# Altium schematic sheet ap-pam-VX.SchDoc: ATA Post Amplifier Module
size A1; Author: Dr. Alexander Pollak; DrawnBy: Dr. Alexander Pollak; DocumentNumber: 1; Revision: 1.0; SheetNumber: 1; SheetTotal: 1
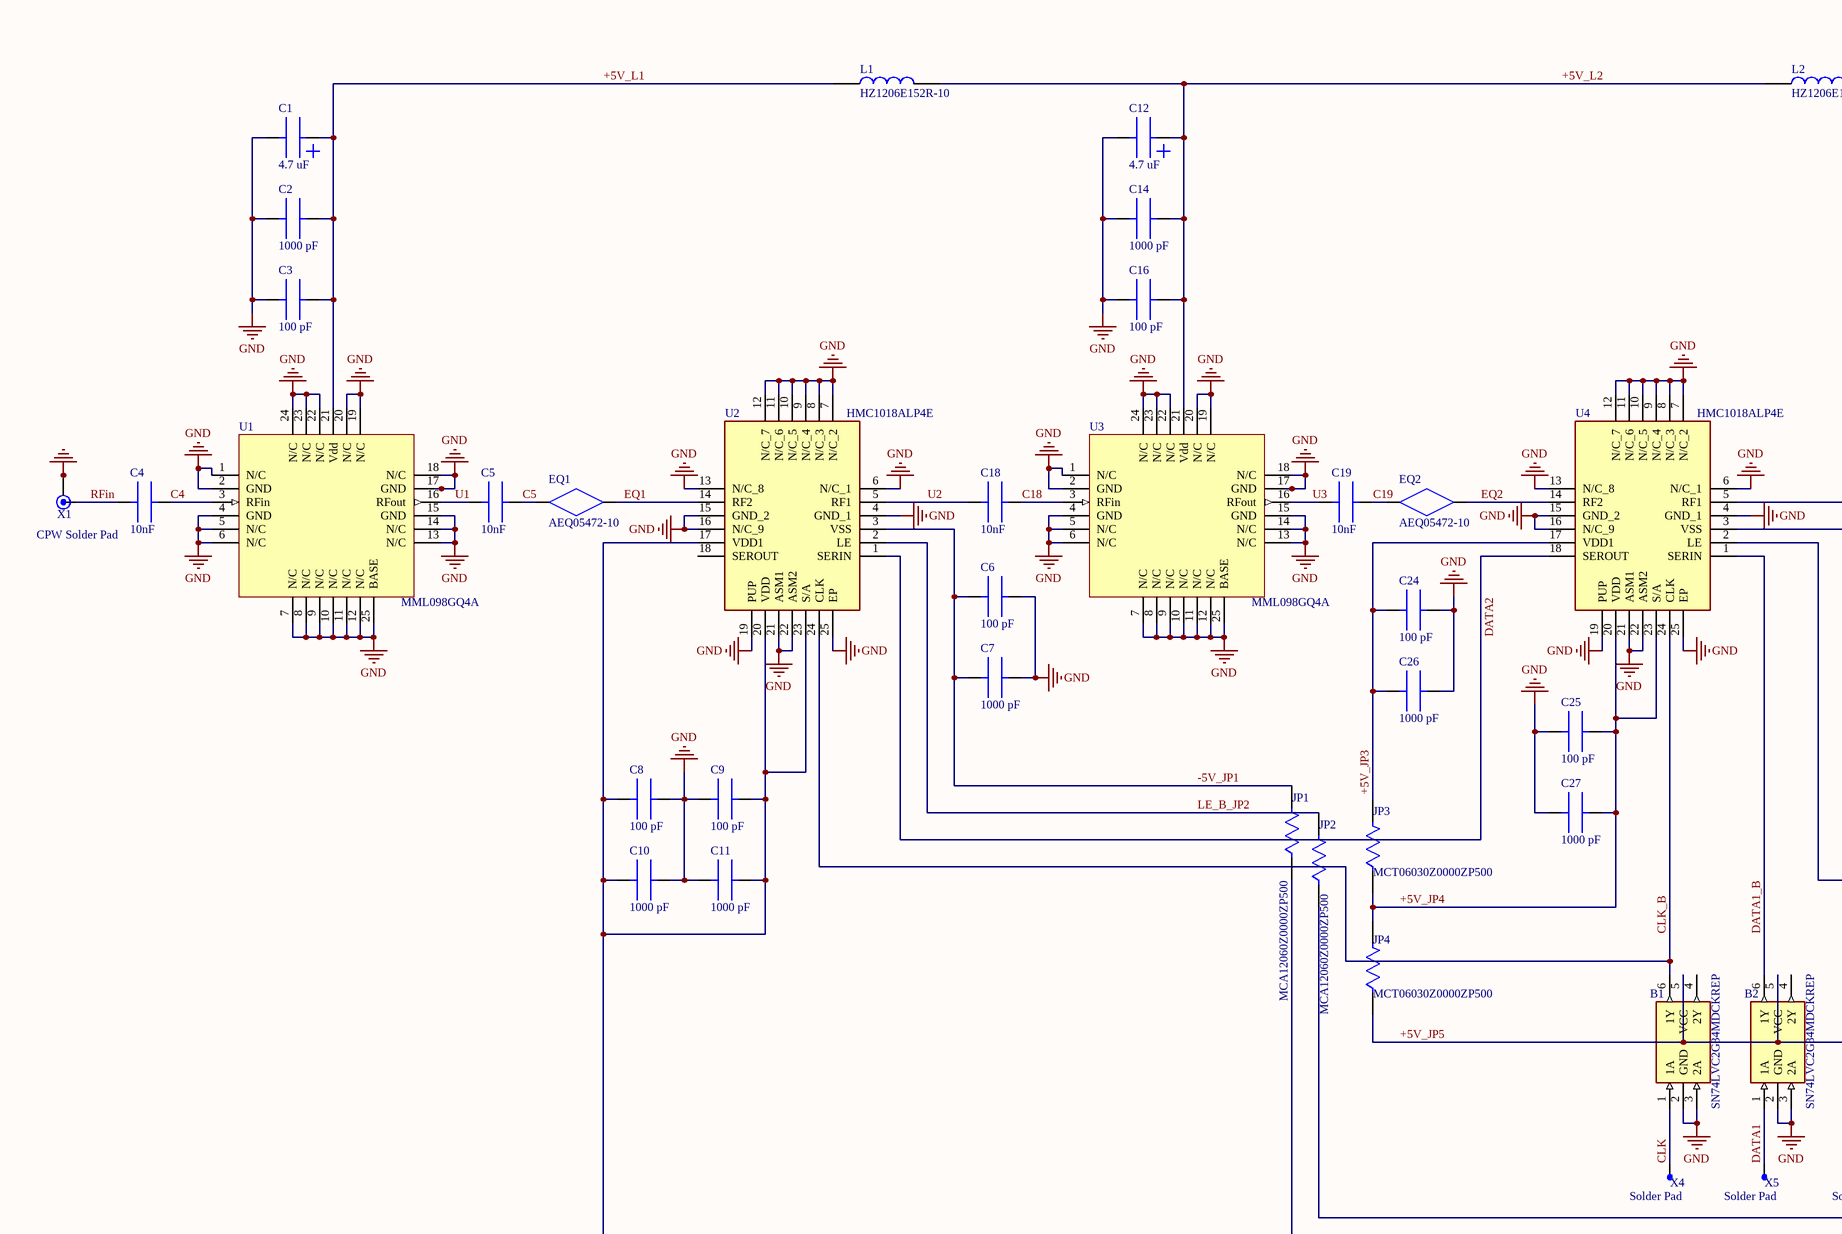
[diagram p0: ap-pam-VX.SchDoc, top left]
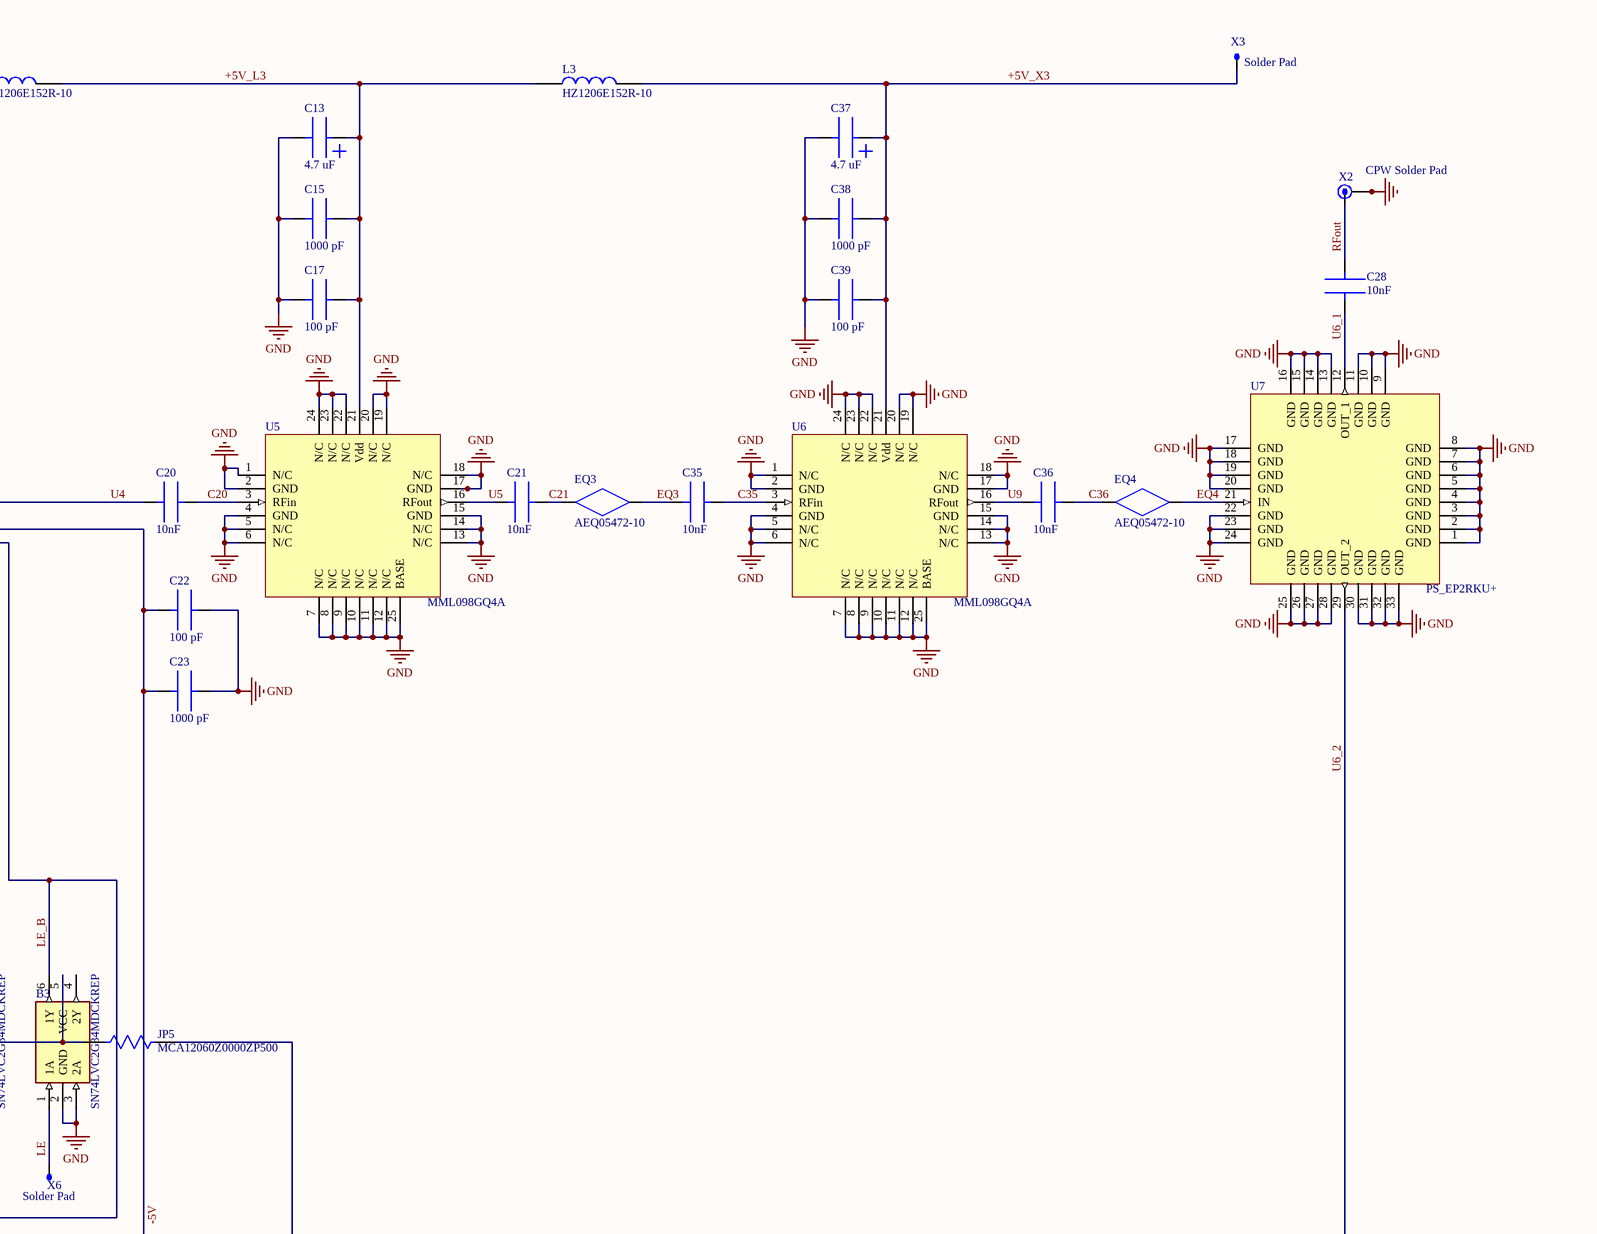
[diagram p1: ap-pam-VX.SchDoc, top right]
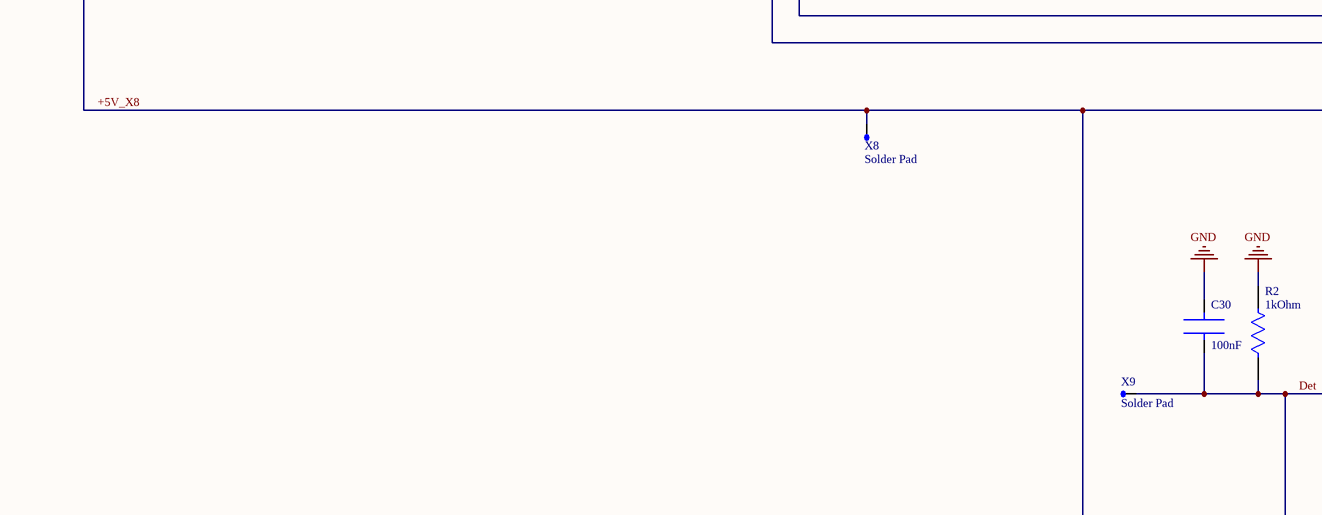
[diagram p2: ap-pam-VX.SchDoc, bottom left]
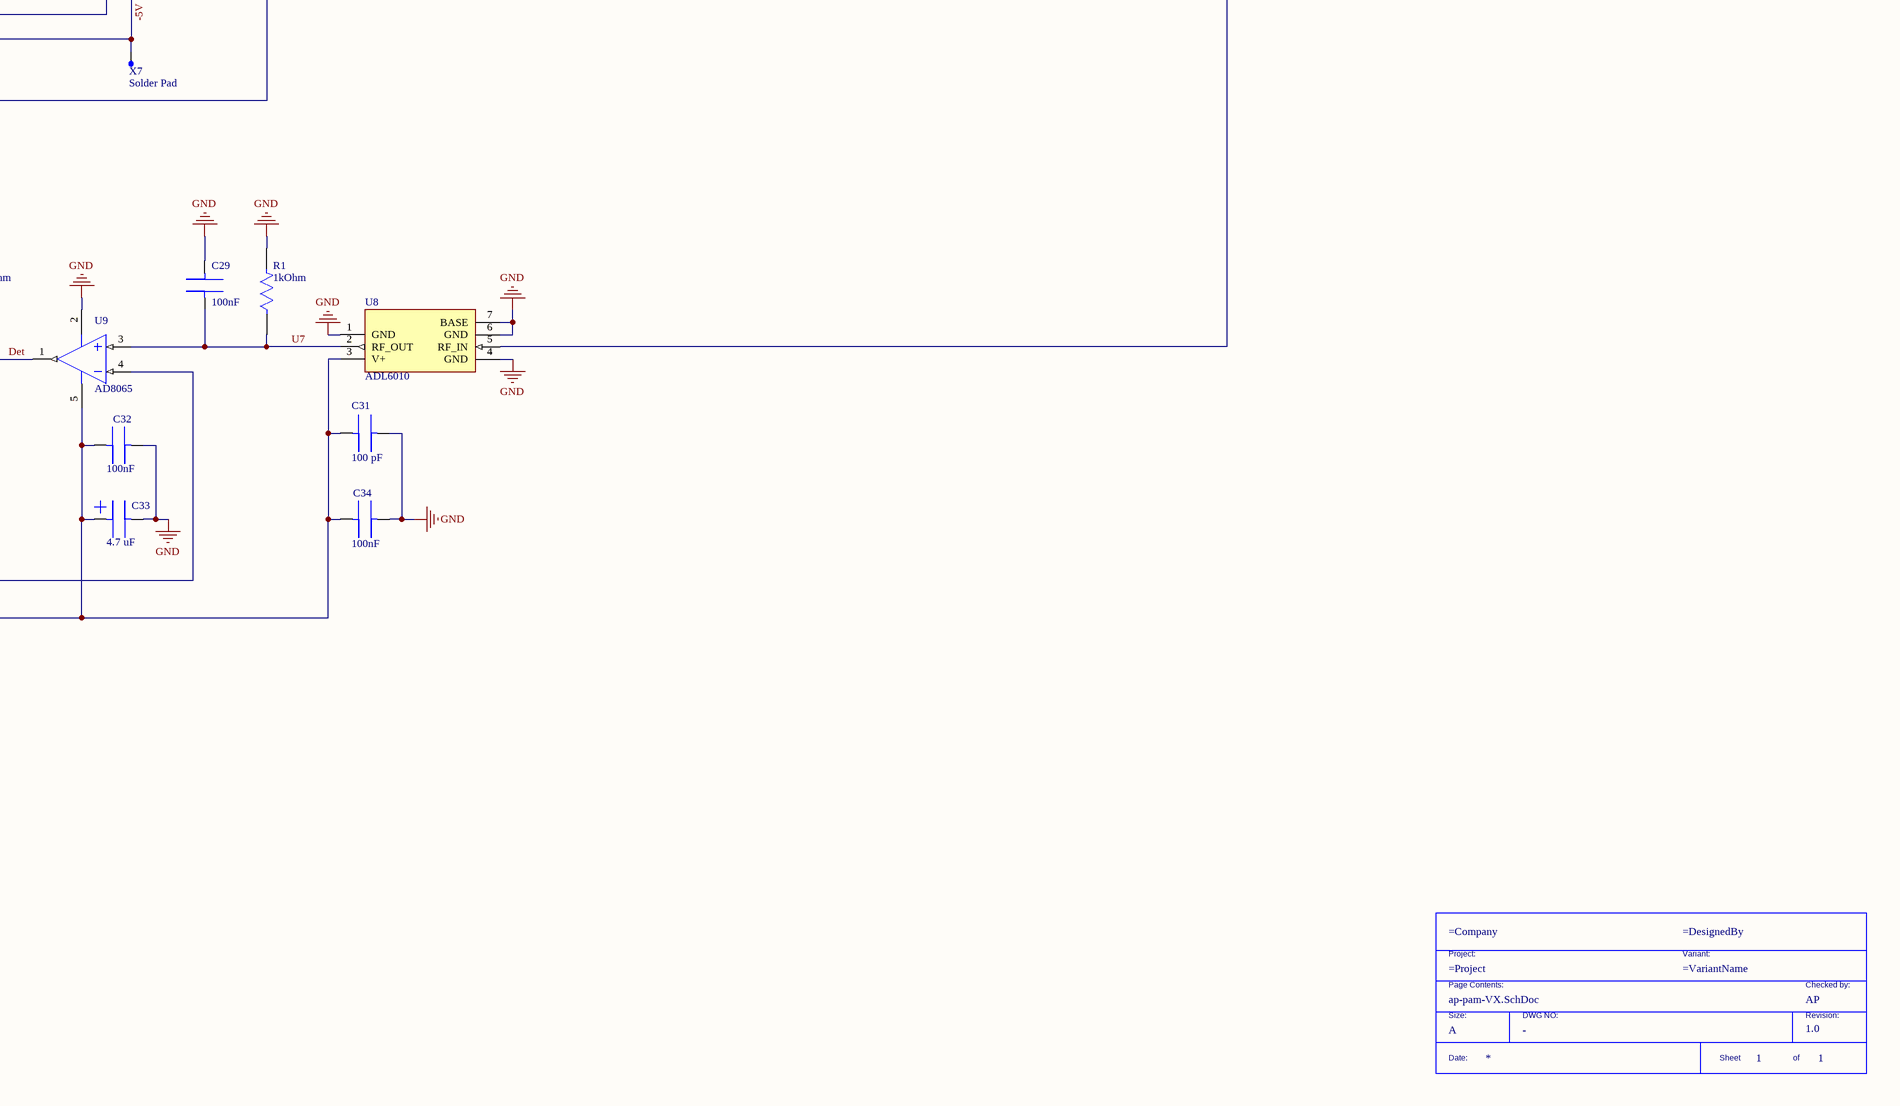
[diagram p3: ap-pam-VX.SchDoc, bottom right]

## Parts
*  Size: A  Checked by: AP  (graphical)
B1  SN74LVC2G34MDCKREP  [buf_SN74LVC2G34MDCKREP]
B2  SN74LVC2G34MDCKREP  [buf_SN74LVC2G34MDCKREP]
B3  SN74LVC2G34MDCKREP  [buf_SN74LVC2G34MDCKREP]
C1  4.7 uF  [C4_7uF]
C2  1000 pF  [C1000pF]
C3  100 pF  [C100pF]
C4  10nF  [C10nF]
C5  10nF  [C10nF]
C6  100 pF  [C100pF]
C7  1000 pF  [C1000pF]
C8  100 pF  [C100pF]
C9  100 pF  [C100pF]
C10  1000 pF  [C1000pF]
C11  1000 pF  [C1000pF]
C12  4.7 uF  [C4_7uF]
C13  4.7 uF  [C4_7uF]
C14  1000 pF  [C1000pF]
C15  1000 pF  [C1000pF]
C16  100 pF  [C100pF]
C17  100 pF  [C100pF]
C18  10nF  [C10nF]
C19  10nF  [C10nF]
C20  10nF  [C10nF]
C21  10nF  [C10nF]
C22  100 pF  [C100pF]
C23  1000 pF  [C1000pF]
C24  100 pF  [C100pF]
C25  100 pF  [C100pF]
C26  1000 pF  [C1000pF]
C27  1000 pF  [C1000pF]
C28  10nF  [C10nF]
C29  100nF  [C1000pF__C100nF]
C30  100nF  [C1000pF__C100nF]
C31  100 pF  [C100pF]
C32  100nF  [C1000pF__C100nF]
C33  4.7 uF  [C4_7uF]
C34  100nF  [C1000pF__C100nF]
C35  10nF  [C10nF]
C36  10nF  [C10nF]
C37  4.7 uF  [C4_7uF]
C38  1000 pF  [C1000pF__C100nF]
C39  100 pF  [C100pF]
EQ1  AEQ05472-10  [EQ_AEQ05472]
EQ2  AEQ05472-10  [EQ_AEQ05472]
EQ3  AEQ05472-10  [EQ_AEQ05472]
EQ4  AEQ05472-10  [EQ_AEQ05472]
JP1  MCA12060Z0000ZP500  [JP_MCA12060Z0000ZP500]
JP2  MCA12060Z0000ZP500  [JP_MCA12060Z0000ZP500]
JP3  MCT06030Z0000ZP500  [JP_small_MCT06030Z0000ZP500]
JP4  MCT06030Z0000ZP500  [JP_small_MCT06030Z0000ZP500]
JP5  MCA12060Z0000ZP500  [JP_MCA12060Z0000ZP500]
L1  HZ1206E152R-10  [FB_HZ1206E152R-10]
L2  HZ1206E152R-10  [FB_HZ1206E152R-10]
L3  HZ1206E152R-10  [FB_HZ1206E152R-10]
R1  1kOhm  [JP_R_MCT06030Z0000ZP500]
R2  1kOhm  [JP_R_MCT06030Z0000ZP500]
U1  MML098GQ4A  [amp_MML098GQ4A]
U2  HMC1018ALP4E  [Att_HMC101018ALPE]
U3  MML098GQ4A  [amp_MML098GQ4A]
U4  HMC1018ALP4E  [Att_HMC101018ALPE]
U5  MML098GQ4A  [amp_MML098GQ4A]
U6  MML098GQ4A  [amp_MML098GQ4A]
U7  PS_EP2RKU+  [PS_EP2RKU+]
U8  ADL6010  [Det_ADL6010ACPZN-R2]
U9  AD8065  [opAmp_AD8065ARTZ-REEL7]
X1  CPW Solder Pad  [CPW Edge Connector]
X2  CPW Solder Pad  [CPW Edge Connector]
X3  Solder Pad  [Solder Pad]
X4  Solder Pad  [Solder Pad]
X5  Solder Pad  [Solder Pad]
X6  Solder Pad  [Solder Pad]
X7  Solder Pad  [Solder Pad]
X8  Solder Pad  [Solder Pad]
X9  Solder Pad  [Solder Pad]

## Nets
GND: B1.2(GND) B1.3(2A) B2.2(GND) B2.3(2A) B3.2(GND) B3.3(2A) C1.2 C2.2 C3.2 C6.2 C7.2 C8.2 C9.2 C10.2 C11.2 C12.2 C13.2 C14.2 C15.2 C16.2 C17.2 C22.2 C23.2 C24.2 C25.2 C26.2 C27.2 C29.2 C30.2 C31.1 C32.1 C33.2 C34.1 C37.2 C38.2 C39.2 R1.2 R2.2 U1.1(N/C) U1.2(GND) U1.4(GND) U1.5(N/C) U1.6(N/C) U1.7(N/C) U1.8(N/C) U1.9(N/C) U1.10(N/C) U1.11(N/C) U1.12(N/C) U1.13(N/C) U1.14(N/C) U1.15(GND) U1.17(GND) U1.18(N/C) U1.19(N/C) U1.20(N/C) U1.22(N/C) U1.23(N/C) U1.24(N/C) U1.25(BASE) U2.4(GND_1) U2.6(N/C_1) U2.7(N/C_2) U2.8(N/C_3) U2.9(N/C_4) U2.10(N/C_5) U2.11(N/C_6) U2.12(N/C_7) U2.13(N/C_8) U2.15(GND_2) U2.16(N/C_9) U2.19(PUP) U2.21(ASM1) U2.22(ASM2) U2.25(EP) U3.1(N/C) U3.2(GND) U3.4(GND) U3.5(N/C) U3.6(N/C) U3.7(N/C) U3.8(N/C) U3.9(N/C) U3.10(N/C) U3.11(N/C) U3.12(N/C) U3.13(N/C) U3.14(N/C) U3.15(GND) U3.17(GND) U3.18(N/C) U3.19(N/C) U3.20(N/C) U3.22(N/C) U3.23(N/C) U3.24(N/C) U3.25(BASE) U4.4(GND_1) U4.6(N/C_1) U4.7(N/C_2) U4.8(N/C_3) U4.9(N/C_4) U4.10(N/C_5) U4.11(N/C_6) U4.12(N/C_7) U4.13(N/C_8) U4.15(GND_2) U4.16(N/C_9) U4.19(PUP) U4.21(ASM1) U4.22(ASM2) U4.25(EP) U5.1(N/C) U5.2(GND) U5.4(GND) U5.5(N/C) U5.6(N/C) U5.7(N/C) U5.8(N/C) U5.9(N/C) U5.10(N/C) U5.11(N/C) U5.12(N/C) U5.13(N/C) U5.14(N/C) U5.15(GND) U5.17(GND) U5.18(N/C) U5.19(N/C) U5.20(N/C) U5.22(N/C) U5.23(N/C) U5.24(N/C) U5.25(BASE) U6.1(N/C) U6.2(GND) U6.4(GND) U6.5(N/C) U6.6(N/C) U6.7(N/C) U6.8(N/C) U6.9(N/C) U6.10(N/C) U6.11(N/C) U6.12(N/C) U6.13(N/C) U6.14(N/C) U6.15(GND) U6.17(GND) U6.18(N/C) U6.19(N/C) U6.20(N/C) U6.22(N/C) U6.23(N/C) U6.24(N/C) U6.25(BASE) U7.1(GND) U7.2(GND) U7.3(GND) U7.4(GND) U7.5(GND) U7.6(GND) U7.7(GND) U7.8(GND) U7.9(GND) U7.10(GND) U7.11(GND) U7.13(GND) U7.14(GND) U7.15(GND) U7.16(GND) U7.17(GND) U7.18(GND) U7.19(GND) U7.20(GND) U7.22(GND) U7.23(GND) U7.24(GND) U7.25(GND) U7.26(GND) U7.27(GND) U7.28(GND) U7.30(GND) U7.31(GND) U7.32(GND) U7.33(GND) U8.1(GND) U8.4(GND) U8.6(GND) U8.7(BASE) U9.2(-VS) X1.2 X1.3 X2.2 X2.3
+5V_JP3: C24.1 C26.1 JP3.2 U4.17(VDD1)
+5V_JP4: C25.1 C27.1 JP3.1 JP4.2 U4.20(VDD) U4.23(S/A)
+5V_JP5: B1.5(VCC) B2.5(VCC) B3.5(VCC) JP4.1 JP5.1
+5V_L1: C1.1(+) C2.1 C3.1 L1.1 U1.21(Vdd)
+5V_L2: C12.1(+) C14.1 C16.1 L1.2 L2.1 U3.21(Vdd)
+5V_L3: C13.1(+) C15.1 C17.1 L2.2 L3.1 U5.21(Vdd)
+5V_X3: C37.1(+) C38.1 C39.1 L3.2 U6.21(Vdd) X3.1
+5V_X8: C8.1 C9.1 C10.1 C11.1 C31.2 C32.2 C33.1(+) C34.2 JP5.2 U2.17(VDD1) U2.20(VDD) U2.23(S/A) U8.3(V+) U9.5(+VS) X8.1
-5V: C22.1 C23.1 JP1.1 U4.3(VSS) X7.1
-5V_JP1: C6.1 C7.1 JP1.2 U2.3(VSS)
C4: C4.2 U1.3(RFin)
C5: C5.2 EQ1.1
C18: C18.2 U3.3(RFin)
C19: C19.2 EQ2.1
C20: C20.2 U5.3(RFin)
C21: C21.2 EQ3.1
C35: C35.2 U6.3(RFin)
C36: C36.2 EQ4.1
CLK: B1.1(1A) X4.1
CLK_B: B1.6(1Y) U2.24(CLK) U4.24(CLK)
DATA1: B2.1(1A) X5.1
DATA1_B: B2.6(1Y) U4.1(SERIN)
DATA2: U2.1(SERIN) U4.18(SEROUT)
Det: C30.1 R2.1 U9.1(VOUT) U9.4(-IN) X9.1
EQ1: EQ1.2 U2.14(RF2)
EQ2: EQ2.2 U4.14(RF2)
EQ3: C35.1 EQ3.2
EQ4: EQ4.2 U7.21(IN)
LE: B3.1(1A) X6.1
LE_B: B3.6(1Y) JP2.1 U4.2(LE)
LE_B_JP2: JP2.2 U2.2(LE)
RFin: C4.1 X1.1
RFout: C28.2 X2.1
U1: C5.1 U1.16(RFout)
U2: C18.1 U2.5(RF1)
U3: C19.1 U3.16(RFout)
U4: C20.1 U4.5(RF1)
U5: C21.1 U5.16(RFout)
U6_1: C28.1 U7.12(OUT_1)
U6_2: U7.29(OUT_2) U8.5(RF_IN)
U7: C29.1 R1.1 U8.2(RF_OUT) U9.3(+IN)
U9: C36.1 U6.16(RFout)

Not connected (* = marked no-connect by the designer): B1 4(2Y); B2 4(2Y); B3 4(2Y); U2 18(SEROUT)

## Notes on the sheet
- (in symbol TitleBlock) Project:; Variant:; Page Contents:; Checked by:; Size:; DWG NO:; Revision:; Date:; Sheet; of

## Library data of the parts
* = TitleBlock: Standard Title Block; DWG NO: -
B1-B3 = Buf_SN74LVC2G34MDCKREP: Enhanced Product Dual Buffer Gate; Manufacturer_Name: Texas Instruments; Geometry.Height: 1.1mm; Mouser Part Number: 595-SN74L2G34MDCKREP; Mouser Price/Stock: https://www.mouser.co.uk/ProductDetail/Texas-Instruments/SN74LVC2G34MDCKREP?qs=l4wu3mKjyfmQ87%252BWHVxJDg%3D%3D; Datasheet Link: https://datasheet.datasheetarchive.com/originals/distributors/Datasheets-SFU2/DSASFU100028688.pdf; Manufacturer Part Number: SN74LVC2G34MDCKREP
C1 C12 C13 C33 C37 = C7_4uF_TH3A475K010C2900: Tantalum Capacitor, Polarized, Tantalum (dry/solid), 10V, 10% +Tol, 10% -Tol, 4.7uF, Surface Mount, 1306; Manufacturer: Vishay Sprague; ESR (Equivalent Series Resistance): 2.9R; Leakage Current: 500nA; Ripple Current: 160mA; Tan Delta: 0.06; Reference Standard: AEC-Q200; Supplier: Future Electronics; Supplier Part Number: 4924098; Manufacturer Part Number: TH3A475K010C2900; RoHS: Yes; Category: Tantalum Capacitors; Stock: 2000; Pricing: 2000=0.178, 4000=0.175, 6000=0.173, 8000=0.171, 10000=0.166 (USD); Mounting Technology: Surface Mount; Pins: 2; Dielectric Material: Tantalum; Package Shape: Rectangular; Case/Package: 1206; Terminal Finish: Tin; Min Operating Temperature: -55°C; Max Operating Temperature: 150°C; JESD-609 Code: e3; Polarity: Polarized; Value: 4.7uF; Capacitor Type: Tantalum; Tolerance  (fill in as +-): 10%; Package Style: SMTMeter; Packaging: Tape and Reel; Tolerance (fill in as +-): 10%; Rated DC Voltage (URdc): 10V; Termination: J BEND; Length: 3.2mm; Width: 1.6mm; Height: 1.6mm; Reach SVHC Compliant: Yes; RoHS Compliant: Yes; ComponentLink1URL: https://datasheet.ciiva.com:443/pdfs/VipMasterIC/IC/VISH/VISH-S-A0010085390/VISH-S-A0010085390-1.pdf?src-supplier=IHS+Markit; ComponentLink1Description: https://datasheet.ciiva.com:443/pdfs/VipMasterIC/IC/VISH/VISH-S-A0010085390/VISH-S-A0010085390-1.pdf?src-supplier=IHS+Markit; ComponentLink2URL: https://datasheet.ciiva.com/268/th3-268785.pdf?src-supplier=Digikey; ComponentLink2Description: https://datasheet.ciiva.com/268/th3-268785.pdf?src-supplier=Digikey; ComponentLink3URL: https://datasheet.ciiva.com/16360/th3-16360891.pdf?src-supplier=Future+Electronics; ComponentLink3Description: https://datasheet.ciiva.com/16360/th3-16360891.pdf?src-supplier=Future+Electronics
C2 C7 C10 C11 C14 C15 C23 C26 C27 = GCM1885C1H102FA16D: Ceramic Capacitor, Multilayer, Ceramic, 50V, 1% +Tol, 1% -Tol, C0G, 30ppm/Cel TC, 0.001uF, Surface Mount, 0603; Manufacturer: Murata; Value: 1nF; Multilayer: Yes; Reference Standard: AEC-Q200; Supplier: Mouser; Supplier Part Number: 81-GCM1885C1H102FA6D; Manufacturer Part Number: GCM1885C1H102FA16D; RoHS: Yes; Category: Ceramic Capacitors; Stock: 27229; Pricing: 1=0.35, 10=0.229, 50=0.229, 100=0.138, 1000=0.092, 10000=0.074 (USD); Mounting Technology: Surface Mount; Pins: 2; Dielectric Material: Ceramic; Package Shape: Rectangular; Case/Package: 0603; Min Operating Temperature: -55°C; Max Operating Temperature: 125°C; Capacitor Type: Ceramic; Tolerance  (fill in as +-): 1%; Packaging: Tape and Reel; Tolerance (fill in as +-): 1%; Rated DC Voltage (URdc): 50V; Temperature Characteristics Code: C0G; Termination: Wraparound; Reach SVHC Compliant: Yes; RoHS Compliant: Yes; ComponentLink1URL: https://datasheet.ciiva.com:443/pdfs/VipMasterIC/IC/MURE/MURE-S-A0004370842/MURE-S-A0004372260-1.pdf?src-supplier=IHS+Markit; ComponentLink1Description: https://datasheet.ciiva.com:443/pdfs/VipMasterIC/IC/MURE/MURE-S-A0004370842/MURE-S-A0004372260-1.pdf?src-supplier=IHS+Markit
C3 C6 C8 C9 C16 C17 C22 C24 C25 = GRM1555C2A101FA01D: Multilayer Ceramic Capacitors MLCC - SMD/SMT 100 pF 100 VDC 1% 0402 C0G (NP0); Manufacturer: Murata; Supplier: Mouser; Supplier Part Number: 81-GRM1555C2A11FA1D; Manufacturer Part Number: GRM1555C2A101FA01D; RoHS: No; Stock: 21646; Pricing: 1=0.18, 10=0.119, 50=0.119, 100=0.06, 1000=0.039, 10000=0.035 (USD)
C4 C5 C18-C21 C28 C35 C36 = C10nF_939113733510: Manufacturer: Murata; Supplier: Mouser; Supplier Part Number: 961-939113733510; Manufacturer Part Number: 939113733510; RoHS: No; Stock: 402; Pricing: 1000=3.63, 10000=3.49 (USD)
C29 C30 C32 C34 = C100nF_GCM188R71C104KA37J: Ceramic Capacitor, Multilayer, Ceramic, 16V, 10% +Tol, 10% -Tol, X7R, 15% TC, 0.1uF, Surface Mount, 0603; Manufacturer: Murata; Multilayer: Yes; Reference Standard: AEC-Q200; Supplier: Mouser; Supplier Part Number: 81-GCM188R71C104KA7J; Manufacturer Part Number: GCM188R71C104KA37J; RoHS: Yes; Category: Ceramic Capacitors; Stock: 1116664; Pricing: 1=0.17, 10=0.097, 50=0.097, 100=0.063, 1000=0.044, 10000=0.031 (USD); Mounting Technology: Surface Mount; Pins: 2; Dielectric Material: Ceramic; Package Shape: Rectangular; Case/Package: 0603; Terminal Finish: Nickel; Min Operating Temperature: -55°C; Max Operating Temperature: 125°C; JESD-609 Code: e3; Value: 100nF; Capacitor Type: Ceramic; Tolerance  (fill in as +-): 10%; Package Style: SMTMeter; Packaging: Tape and Reel; Tolerance (fill in as +-): 10%; Rated DC Voltage (URdc): 16V; Temperature Characteristics Code: X7R; Termination: Wraparound; Length: 1.6mm; Width: 0.8mm; Height: 0.9mm; Reach SVHC Compliant: Yes; RoHS Compliant: Yes; ComponentLink1URL: https://datasheet.ciiva.com:443/pdfs/VipMasterIC/IC/MURE/MURE-S-A0004370842/MURE-S-A0004371613-1.pdf?src-supplier=IHS+Markit; ComponentLink1Description: https://datasheet.ciiva.com:443/pdfs/VipMasterIC/IC/MURE/MURE-S-A0004370842/MURE-S-A0004371613-1.pdf?src-supplier=IHS+Markit; ComponentLink2URL: https://datasheet.ciiva.com/18183/getdatasheetpartid-140967-18183600.pdf?src-supplier=Verical; ComponentLink2Description: https://datasheet.ciiva.com/18183/getdatasheetpartid-140967-18183600.pdf?src-supplier=Verical; ComponentLink3URL: https://datasheet.ciiva.com/29540/product-29540843.pdf?src-supplier=Digikey; ComponentLink3Description: https://datasheet.ciiva.com/29540/product-29540843.pdf?src-supplier=Digikey; ComponentLink4URL: https://datasheet.ciiva.com/29540/product-29540844.pdf?src-supplier=Digikey; ComponentLink4Description: https://datasheet.ciiva.com/29540/product-29540844.pdf?src-supplier=Digikey; ComponentLink5URL: https://datasheet.ciiva.com/29540/product-29540842.pdf?src-supplier=Digikey; ComponentLink5Description: https://datasheet.ciiva.com/29540/product-29540842.pdf?src-supplier=Digikey
C31 C39 = C100pF_GRM1555C2A101FA01D: Multilayer Ceramic Capacitors MLCC - SMD/SMT 100 pF 100 VDC 1% 0402 C0G (NP0); Manufacturer: Murata; Supplier: Mouser; Supplier Part Number: 81-GRM1555C2A11FA1D; Manufacturer Part Number: GRM1555C2A101FA01D; RoHS: No; Stock: 21646; Pricing: 1=0.18, 10=0.119, 50=0.119, 100=0.06, 1000=0.039, 10000=0.035 (USD)
C38 = C1000pF_GCM1885C1H102FA16D: Ceramic Capacitor, Multilayer, Ceramic, 50V, 1% +Tol, 1% -Tol, C0G, 30ppm/Cel TC, 0.001uF, Surface Mount, 0603; Manufacturer: Murata; Value: 1nF; Multilayer: Yes; Reference Standard: AEC-Q200; Supplier: Mouser; Supplier Part Number: 81-GCM1885C1H102FA6D; Manufacturer Part Number: GCM1885C1H102FA16D; RoHS: Yes; Category: Ceramic Capacitors; Stock: 27229; Pricing: 1=0.35, 10=0.229, 50=0.229, 100=0.138, 1000=0.092, 10000=0.074 (USD); Mounting Technology: Surface Mount; Pins: 2; Dielectric Material: Ceramic; Package Shape: Rectangular; Case/Package: 0603; Min Operating Temperature: -55°C; Max Operating Temperature: 125°C; Capacitor Type: Ceramic; Tolerance  (fill in as +-): 1%; Packaging: Tape and Reel; Tolerance (fill in as +-): 1%; Rated DC Voltage (URdc): 50V; Temperature Characteristics Code: C0G; Termination: Wraparound; Reach SVHC Compliant: Yes; RoHS Compliant: Yes; ComponentLink1URL: https://datasheet.ciiva.com:443/pdfs/VipMasterIC/IC/MURE/MURE-S-A0004370842/MURE-S-A0004372260-1.pdf?src-supplier=IHS+Markit; ComponentLink1Description: https://datasheet.ciiva.com:443/pdfs/VipMasterIC/IC/MURE/MURE-S-A0004370842/MURE-S-A0004372260-1.pdf?src-supplier=IHS+Markit
EQ1-EQ4 = EQ_AEQ05472-10: Rf Filter Gain Equalizer 2SMD; Manufacturer: Knowles Dielectric Labs; Supplier: Digikey; Supplier Part Number: 1761-1006-ND; Manufacturer Part Number: AEQ05472-10; RoHS: Yes; Stock: 390; Pricing: 10=7.145, 20=6.5195, 30=6.203, 50=5.8498, 70=5.64214, 100=5.4415, 250=5.00556, 500=4.7401, 1000=4.51981 (USD); ComponentLink1URL: http://www.mouser.com/ds/2/110/Dielectriclaboratories_EW_Series-340573.pdf?src-supplier=Mouser; ComponentLink1Description: http://www.mouser.com/ds/2/110/Dielectriclaboratories_EW_Series-340573.pdf?src-supplier=Mouser; ComponentLink2URL: http://www.knowlescapacitors.com/getattachment/69df7735-7ed2-4c4f-903b-a99acda4fa2d/Gain-Equalizers.aspx?src-supplier=Digikey; ComponentLink2Description: http://www.knowlescapacitors.com/getattachment/69df7735-7ed2-4c4f-903b-a99acda4fa2d/Gain-Equalizers.aspx?src-supplier=Digikey
JP1 JP2 JP5 = JP_MCA12060Z0000ZP500: Fixed Resistor, Thin Film, 0.25W, 0ohm, Surface Mount, 1206; Manufacturer: Vishay; Power: 250mW; Rated Temperature: 70°C; Value: 0R; Package Height: 0.55mm; Package Length: 3.2mm; Package Width: 1.6mm; Reference Standard: CECC40401-801; Supplier: Mouser; Supplier Part Number: 594-MCA12060Z0000ZP5; Manufacturer Part Number: MCA12060Z0000ZP500; RoHS: Yes; Category: Chip SMD Resistors; Stock: 3183; Pricing: 1=0.44, 10=0.318, 50=0.245, 100=0.218, 1000=0.132, 10000=0.117 (USD); Mounting Technology: Surface Mount; Pins: 2; Package Shape: Rectangular; Case/Package: 1206; Terminal Finish: Nickel; Min Operating Temperature: -55°C; Max Operating Temperature: 125°C; JESD-609 Code: e3; Resistor Type: FIXED RESISTOR; Construction: Rectangular; Packaging: Tape and Reel; Technology: THIN FILM; Termination: Wraparound; Reach SVHC Compliant: Yes; RoHS Compliant: Yes
JP3 JP4 = JP_small_MCT06030Z0000ZP500: Fixed Resistor, Thin Film, 0.1W, 0ohm, Surface Mount, 0603; Manufacturer: Vishay Beyschlag; Power: 100mW; Rated Temperature: 70°C; Value: 0R; Package Height: 0.45mm; Package Length: 1.55mm; Package Width: 0.85mm; Reference Standard: CECC40401-801; Supplier: Mouser; Supplier Part Number: 594-MCT06030Z0000ZP5; Manufacturer Part Number: MCT06030Z0000ZP500; RoHS: Yes; Category: Chip SMD Resistors; Stock: 102669; Pricing: 1=0.24, 10=0.09, 50=0.09, 100=0.063, 1000=0.04, 10000=0.028 (USD); Mounting Technology: Surface Mount; Pins: 2; Package Shape: Rectangular; Case/Package: 0603; Terminal Finish: Nickel; Min Operating Temperature: -55°C; Max Operating Temperature: 125°C; JESD-609 Code: e3; Resistor Type: FIXED RESISTOR; Construction: Rectangular; Packaging: Tape and Reel; Technology: THIN FILM; Termination: Wraparound; Reach SVHC Compliant: Yes; RoHS Compliant: Yes; ComponentLink1URL: https://datasheet.ciiva.com:443/pdfs/VipMasterIC/IC/VISH/VISH-S-A0002473667/VISH-S-A0002473667-1.pdf?src-supplier=IHS+Markit; ComponentLink1Description: https://datasheet.ciiva.com:443/pdfs/VipMasterIC/IC/VISH/VISH-S-A0002473667/VISH-S-A0002473667-1.pdf?src-supplier=IHS+Markit; ComponentLink2URL: https://datasheet.ciiva.com/48524/mc-pro-48524221.pdf?src-supplier=Avnet; ComponentLink2Description: https://datasheet.ciiva.com/48524/mc-pro-48524221.pdf?src-supplier=Avnet; ComponentLink3URL: https://datasheet.ciiva.com/8901/mc-pro-8901833.pdf?src-supplier=Avnet; ComponentLink3Description: https://datasheet.ciiva.com/8901/mc-pro-8901833.pdf?src-supplier=Avnet; ComponentLink4URL: https://datasheet.ciiva.com/8898/mc-pro-8898078.pdf?src-supplier=Avnet; ComponentLink4Description: https://datasheet.ciiva.com/8898/mc-pro-8898078.pdf?src-supplier=Avnet; ComponentLink5URL: https://datasheet.ciiva.com/2471/mc-pro-2471991.pdf?src-supplier=Digikey; ComponentLink5Description: https://datasheet.ciiva.com/2471/mc-pro-2471991.pdf?src-supplier=Digikey; ComponentLink6URL: https://datasheet.ciiva.com/2471/mc-pro-2471992.pdf?src-supplier=Digikey; ComponentLink6Description: https://datasheet.ciiva.com/2471/mc-pro-2471992.pdf?src-supplier=Digikey; ComponentLink7URL: https://datasheet.ciiva.com/2471/mc-pro-2471993.pdf?src-supplier=Digikey; ComponentLink7Description: https://datasheet.ciiva.com/2471/mc-pro-2471993.pdf?src-supplier=Digikey; ComponentLink8URL: https://datasheet.ciiva.com/16451/mc-pro-16451398.pdf?src-supplier=Future+Electronics; ComponentLink8Description: https://datasheet.ciiva.com/16451/mc-pro-16451398.pdf?src-supplier=Future+Electronics
L1-L3 = FB_HZ1206E152R-10: Ferrite Chip, 1 Function(s), 0.5A, 2 Pin(s); Manufacturer: Laird; DC Resistance-Max: 300mR; Clock Frequency: 50MHz; Channels: 1; Output Impedance: 1.5kR; Current Rating: 500mA; Supplier: Digikey; Supplier Part Number: 240-2548-1-ND; Manufacturer Part Number: HZ1206E152R-10; RoHS: Yes; Category: Ferrite Beads and Chips; Stock: 35353; Pricing: 1=0.24, 10=0.164, 25=0.142, 50=0.127, 100=0.1134, 250=0.09704, 500=0.08584, 1000=0.07554 (USD); Mounting Technology: Surface Mount; Material: Ferrite; Case Code: 1206; Terminal Finish: Nickel; Min Operating Temperature: -55°C; Max Operating Temperature: 125°C; JESD-609 Code: e3; Construction: Chip Bead; Filter Type: FERRITE CHIP; Min Frequency: 50MHz; Manufacturer Series: HZ1206E152R; Packaging: Tape and Reel; Series: HZ1206E152R-10; Length: 3.2mm; Width: 1.6mm; Height: 1.1mm; Reach SVHC Compliant: Yes; RoHS Compliant: Yes; ComponentLink1URL: https://datasheet.ciiva.com:443/pdfs/VipMasterIC/IC/STWD/STWDS00487/STWDS00487-1.pdf?src-supplier=IHS+Markit; ComponentLink1Description: https://datasheet.ciiva.com:443/pdfs/VipMasterIC/IC/STWD/STWDS00487/STWDS00487-1.pdf?src-supplier=IHS+Markit; ComponentLink2URL: https://datasheet.ciiva.com/1013/hz1206e152r-10-b-1013323.pdf?src-supplier=Digikey; ComponentLink2Description: https://datasheet.ciiva.com/1013/hz1206e152r-10-b-1013323.pdf?src-supplier=Digikey; ComponentLink3URL: https://datasheet.ciiva.com/22622/1685976-22622840.pdf?src-supplier=Element14; ComponentLink3Description: https://datasheet.ciiva.com/22622/1685976-22622840.pdf?src-supplier=Element14; ComponentLink4URL: https://datasheet.ciiva.com/12396/hz1206e152r-10new-201540-12396726.pdf?src-supplier=Mouser; ComponentLink4Description: https://datasheet.ciiva.com/12396/hz1206e152r-10new-201540-12396726.pdf?src-supplier=Mouser
R1 R2 = R_1kOhm_MCT06030C1001FPW00: Fixed Resistor, Thin Film, 0.1W, 1000ohm, 75V, 1% +/-Tol, 50ppm/Cel, Surface Mount, 0603; Manufacturer: Vishay BCcomponents; Power: 100mW; Rated Temperature: 70°C; Value: 1kR; Temperature Coefficient (ppm/Cel): 50; Package Height: 0.45mm; Package Length: 1.55mm; Package Width: 0.85mm; Reference Standard: CECC40401-801; Supplier: Mouser; Supplier Part Number: 594-MCT06030C1001FPW; Manufacturer Part Number: MCT06030C1001FPW00; RoHS: Yes; Category: Chip SMD Resistors; Stock: 43742; Pricing: 1=0.1, 10=0.039, 50=0.039, 100=0.035, 1000=0.021, 10000=0.014 (USD); Mounting Technology: Surface Mount; Pins: 2; Package Shape: Rectangular; Case/Package: 0603; Terminal Finish: Nickel; Min Operating Temperature: -55°C; Max Operating Temperature: 125°C; Tolerance: 1%; JESD-609 Code: e3; Resistor Type: FIXED RESISTOR; Construction: Rectangular; Packaging: Tape and Reel; Technology: THIN FILM; Termination: Wraparound; Working Voltage: 75V; Reach SVHC Compliant: Yes; RoHS Compliant: Yes; ComponentLink1URL: https://datasheet.ciiva.com:443/pdfs/VipMasterIC/IC/VISH/VISH-S-A0002473667/VISH-S-A0002473667-1.pdf?src-supplier=IHS+Markit; ComponentLink1Description: https://datasheet.ciiva.com:443/pdfs/VipMasterIC/IC/VISH/VISH-S-A0002473667/VISH-S-A0002473667-1.pdf?src-supplier=IHS+Markit; ComponentLink2URL: http://components.arrow.com/part/dataview/43585914S9217422N4052?src-supplier=Arrow+Electronics; ComponentLink2Description: http://components.arrow.com/part/dataview/43585914S9217422N4052?src-supplier=Arrow+Electronics; ComponentLink3URL: https://datasheet.octopart.com/MCT06030C1001FPW00-Vishay-datasheet-81842982.pdf?src-supplier=Future+Electronics; ComponentLink3Description: https://datasheet.octopart.com/MCT06030C1001FPW00-Vishay-datasheet-81842982.pdf?src-supplier=Future+Electronics
U1 U3 U5 = amp_MML098GQ4A: Low Noise Amplifier / Low current consumption / Low noise figure / Pb-free RoHS compliant QFN package / Ultra wideband performance / Positive bias / Ready for Space Qualification; Frequency (GHz): 0.05-20.00; Gain (dB): 23.00; Output P1dB (dBm): 12.00; Current (mA): 57; Noise Figure (dB): 2.3; Voltage (VDC): 5.0; Manufacturer Part Number: MML098GQ4A
U2 U4 = Att_HMC1018ALP4E: Attenuators Attenuators; Manufacturer_Name: Analog Devices; Geometry.Height: 1mm; Mouser Part Number: 584-HMC1018ALP4E; Mouser Price/Stock: https://www.mouser.co.uk/ProductDetail/Analog-Devices/HMC1018ALP4E?qs=XflvcvBPbgW0VxFFfcxVBA%3D%3D; Datasheet Link: https://www.analog.com/media/en/technical-documentation/data-sheets/hmc1018a.pdf; Manufacturer Part Number: HMC1018ALP4E
U6 = amp_MML098GQ4A: Low Noise Amplifier / Low current consumption / Low noise figure / Pb-free RoHS compliant QFN package / Ultra wideband performance / Positive bias / Ready for Space Qualification; Frequency (GHz): 0.05-20.00; Gain (dB): 23.00; Noise Figure (dB): 2.3; Output P1dB (dBm): 12.00; Voltage (VDC): 5.0; Current (mA): 57; Manufacturer Part Number: MML098GQ4A
U7 = PS_EP2RKU+: Splitter And Combiner; Manufacturer: Mini-Circuits; Supplier: Digikey; Supplier Part Number: 3157-EP2RKU+CT-ND; Manufacturer Part Number: EP2RKU+; RoHS: Yes; Category: RF Semiconductors and Devices; Stock: 2184; Pricing: 1=33.39, 20=30.288, 50=29.1842, 100=28.9081, 200=27.99605 (USD); RoHS Compliant: Yes
U8 = det_ADL6010ACPZN-R2: Linear Detector, 500MHz Min, 43500MHz Max, 20dBm Input Power-Max; Manufacturer: Analog Devices; Supplier: Mouser; Supplier Part Number: 584-ADL6010ACPZN-R2; Manufacturer Part Number: ADL6010ACPZN-R2; RoHS: Yes; Category: RF Semiconductors and Devices; Stock: 808; Pricing: 1=162.98, 10=153.49, 50=153.49, 100=153.49, 1000=153.49, 10000=153.49 (USD); RF/Microwave Device Type: LINEAR DETECTOR; Reach SVHC Compliant: Yes; RoHS Compliant: Yes; ComponentLink1URL: https://datasheet.ciiva.com:443/pdfs/VipMasterIC/IC/ANDI/ANDI-S-A0008998713/ANDI-S-A0008998713-1.pdf?src-supplier=IHS+Markit; ComponentLink1Description: https://datasheet.ciiva.com:443/pdfs/VipMasterIC/IC/ANDI/ANDI-S-A0008998713/ANDI-S-A0008998713-1.pdf?src-supplier=IHS+Markit; ComponentLink2URL: https://datasheet.ciiva.com/29985/adl6010-29985760.pdf?src-supplier=Avnet; ComponentLink2Description: https://datasheet.ciiva.com/29985/adl6010-29985760.pdf?src-supplier=Avnet
U9 = opAmp_AD8065ARTZ-REEL7: Operational Amplifier, 1 Func, BIPolar, PDSO5; Manufacturer: Analog Devices; Package Body Material: Plastic; Bandwidth-Nom: 145MHz; Consumer IC Type: VIDEO AMPLIFIER; Number of Channels: 1; Max Supply Voltage: 12V; Min Supply Voltage: 2.5V; Time @ Peak Reflow Temperature-Max (s): 40s; Qualification Status: Not Qualified; Supplier: Mouser; Supplier Part Number: 584-AD8065ARTZ-R7; Manufacturer Part Number: AD8065ARTZ-REEL7; RoHS: Yes; Category: Amplifiers - Op Amps, Buffer, Instrumentation; Stock: 85532; Pricing: 1=6.36, 10=3.77, 50=3.77, 100=3.13, 1000=2.6, 10000=2.59 (USD); Case/Package: LSSOP; Pins: 5; Package Shape: Rectangular; Terminal Finish: Tin; Min Operating Temperature: -40°C; Max Operating Temperature: 85°C; JESD-609 Code: e3; JESD-30 Code: R-PDSO-G5; Moisture Sensitivity Level: 1; Channels: 1; Package Style: SMALL OUTLINE, LOW PROFILE, SHRINK PITCHMeter; Peak Reflow Temperature (Cel): 260°C; Surface Mount: Yes; Technology: BIPOLAR; Terminal Form: Gull Wing; Terminal Position: DUAL; Length: 2.9mm; Width: 1.6mm; Height - Seated (Max): 1.45mm; Terminal Pitch: 0.95mm; Temperature Grade: INDUSTRIAL; Reach SVHC Compliant: Yes; RoHS Compliant: Yes; ComponentLink1URL: https://datasheet.ciiva.com:443/pdfs/VipMasterIC/IC/ANDI/ANDI-S-A0007455537/ANDI-S-A0007455537-1.pdf?src-supplier=IHS+Markit; ComponentLink1Description: https://datasheet.ciiva.com:443/pdfs/VipMasterIC/IC/ANDI/ANDI-S-A0007455537/ANDI-S-A0007455537-1.pdf?src-supplier=IHS+Markit; ComponentLink2URL: https://datasheet.ciiva.com/1794/ad8065-8066-1794192.pdf?src-supplier=Digikey; ComponentLink2Description: https://datasheet.ciiva.com/1794/ad8065-8066-1794192.pdf?src-supplier=Digikey; ComponentLink3URL: https://datasheet.ciiva.com/46387/1906158-46387195.pdf?src-supplier=Element14; ComponentLink3Description: https://datasheet.ciiva.com/46387/1906158-46387195.pdf?src-supplier=Element14; ComponentLink4URL: https://datasheet.ciiva.com/8078/1906158-8078715.pdf?src-supplier=Element14; ComponentLink4Description: https://datasheet.ciiva.com/8078/1906158-8078715.pdf?src-supplier=Element14; ComponentLink5URL: https://datasheet.ciiva.com/28388/1906158-28388634.pdf?src-supplier=Element14; ComponentLink5Description: https://datasheet.ciiva.com/28388/1906158-28388634.pdf?src-supplier=Element14; ComponentLink6URL: https://datasheet.ciiva.com/1794/ad8065-8066-1794191.pdf?src-supplier=Digikey; ComponentLink6Description: https://datasheet.ciiva.com/1794/ad8065-8066-1794191.pdf?src-supplier=Digikey; ComponentLink7URL: https://datasheet.ciiva.com/1794/ad8065-8066-1794193.pdf?src-supplier=Digikey; ComponentLink7Description: https://datasheet.ciiva.com/1794/ad8065-8066-1794193.pdf?src-supplier=Digikey; ComponentLink8URL: https://datasheet.ciiva.com/2972/ad8065-8066-2972973.pdf?src-supplier=Avnet; ComponentLink8Description: https://datasheet.ciiva.com/2972/ad8065-8066-2972973.pdf?src-supplier=Avnet; ComponentLink9URL: https://datasheet.ciiva.com/15410/ad8065-8066-246489-15410250.pdf?src-supplier=Mouser; ComponentLink9Description: https://datasheet.ciiva.com/15410/ad8065-8066-246489-15410250.pdf?src-supplier=Mouser; ComponentLink10URL: https://datasheet.ciiva.com/48709/001248924-da-01-en-ic-opamp-v-ad8065artz-reel7-sot-23-5-adi-48709574.pdf?src-supplier=Conrad; ComponentLink10Description: https://datasheet.ciiva.com/48709/001248924-da-01-en-ic-opamp-v-ad8065artz-reel7-sot-23-5-adi-48709574.pdf?src-supplier=Conrad
X1 X2 = RF  CPW Solder Pad: Solder pad for RF Coplanar Waveguide Rogers 4350B Thickness 0.020" Copper 1oz
X3-X9 = Solder Pad: Pad to solder wires to